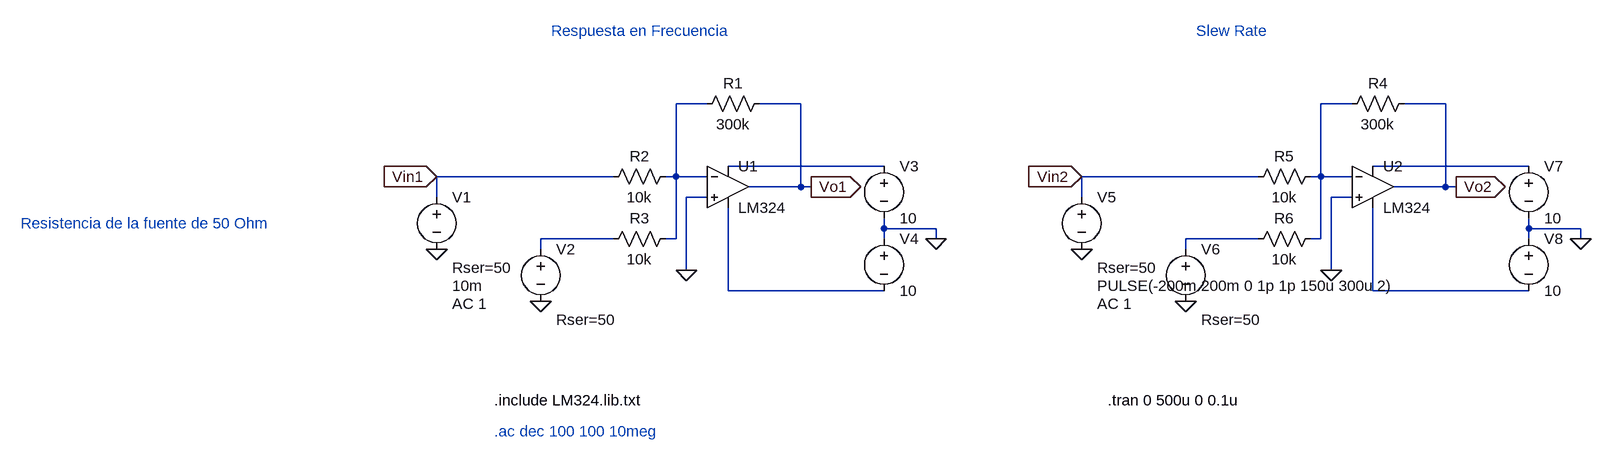
[diagram p0: schematic TP2_2.asc]
TP2_2.asc, the LTspice schematic file:
Version 4
SHEET 1 4432 1132
WIRE 176 -80 128 -80
WIRE 320 -80 256 -80
WIRE 1168 -80 1120 -80
WIRE 1312 -80 1248 -80
WIRE 448 16 208 16
WIRE 1440 16 1200 16
WIRE 32 32 -240 32
WIRE 128 32 128 -80
WIRE 128 32 112 32
WIRE 176 32 128 32
WIRE 1024 32 752 32
WIRE 1120 32 1120 -80
WIRE 1120 32 1104 32
WIRE 1168 32 1120 32
WIRE 320 48 320 -80
WIRE 320 48 240 48
WIRE 336 48 320 48
WIRE 1312 48 1312 -80
WIRE 1312 48 1232 48
WIRE 1328 48 1312 48
WIRE -240 64 -240 32
WIRE 176 64 144 64
WIRE 752 64 752 32
WIRE 1168 64 1136 64
WIRE 448 112 448 96
WIRE 528 112 448 112
WIRE 1440 112 1440 96
WIRE 1520 112 1440 112
WIRE 32 128 -80 128
WIRE 128 128 128 32
WIRE 128 128 112 128
WIRE 448 128 448 112
WIRE 528 128 528 112
WIRE 1024 128 912 128
WIRE 1120 128 1120 32
WIRE 1120 128 1104 128
WIRE 1440 128 1440 112
WIRE 1520 128 1520 112
WIRE -80 144 -80 128
WIRE 912 144 912 128
WIRE 144 176 144 64
WIRE 1136 176 1136 64
WIRE 208 208 208 80
WIRE 448 208 208 208
WIRE 1200 208 1200 80
WIRE 1440 208 1200 208
FLAG -80 224 0
FLAG -240 144 0
FLAG 528 128 0
FLAG 144 176 0
FLAG 336 48 Vo1
IOPIN 336 48 Out
FLAG -240 32 Vin1
IOPIN -240 32 In
FLAG 912 224 0
FLAG 752 144 0
FLAG 1520 128 0
FLAG 1136 176 0
FLAG 1328 48 Vo2
IOPIN 1328 48 Out
FLAG 752 32 Vin2
IOPIN 752 32 In
SYMBOL voltage -240 48 R0
WINDOW 123 24 180 Left 2
WINDOW 39 24 124 Left 2
WINDOW 3 24 152 Left 2
SYMATTR Value2 AC 1
SYMATTR SpiceLine Rser=50
SYMATTR Value 10m
SYMATTR InstName V1
SYMBOL voltage -80 128 R0
WINDOW 123 0 0 Left 0
WINDOW 39 24 124 Left 2
SYMATTR SpiceLine Rser=50
SYMATTR InstName V2
SYMATTR Value ""
SYMBOL OpAmps\\opamp2 208 -16 R0
SYMATTR InstName U1
SYMATTR Value LM324
SYMBOL voltage 448 0 R0
WINDOW 123 0 0 Left 0
WINDOW 39 0 0 Left 0
SYMATTR InstName V3
SYMATTR Value 10
SYMBOL res 272 -96 R90
WINDOW 0 0 56 VBottom 2
WINDOW 3 32 56 VTop 2
SYMATTR InstName R1
SYMATTR Value 300k
SYMBOL res 128 16 R90
WINDOW 0 0 56 VBottom 2
WINDOW 3 32 56 VTop 2
SYMATTR InstName R2
SYMATTR Value 10k
SYMBOL res 128 112 R90
WINDOW 0 0 56 VBottom 2
WINDOW 3 32 56 VTop 2
SYMATTR InstName R3
SYMATTR Value 10k
SYMBOL voltage 448 112 R0
WINDOW 123 0 0 Left 0
WINDOW 39 0 0 Left 0
SYMATTR InstName V4
SYMATTR Value 10
SYMBOL voltage 752 48 R0
WINDOW 123 24 180 Left 2
WINDOW 39 24 124 Left 2
WINDOW 3 24 152 Left 2
SYMATTR Value2 AC 1
SYMATTR SpiceLine Rser=50
SYMATTR Value PULSE(-200m 200m 0 1p 1p 150u 300u 2)
SYMATTR InstName V5
SYMBOL voltage 912 128 R0
WINDOW 123 0 0 Left 0
WINDOW 39 24 124 Left 2
SYMATTR SpiceLine Rser=50
SYMATTR InstName V6
SYMATTR Value ""
SYMBOL OpAmps\\opamp2 1200 -16 R0
SYMATTR InstName U2
SYMATTR Value LM324
SYMBOL voltage 1440 0 R0
WINDOW 123 0 0 Left 0
WINDOW 39 0 0 Left 0
SYMATTR InstName V7
SYMATTR Value 10
SYMBOL res 1264 -96 R90
WINDOW 0 0 56 VBottom 2
WINDOW 3 32 56 VTop 2
SYMATTR InstName R4
SYMATTR Value 300k
SYMBOL res 1120 16 R90
WINDOW 0 0 56 VBottom 2
WINDOW 3 32 56 VTop 2
SYMATTR InstName R5
SYMATTR Value 10k
SYMBOL res 1120 112 R90
WINDOW 0 0 56 VBottom 2
WINDOW 3 32 56 VTop 2
SYMATTR InstName R6
SYMATTR Value 10k
SYMBOL voltage 1440 112 R0
WINDOW 123 0 0 Left 0
WINDOW 39 0 0 Left 0
SYMATTR InstName V8
SYMATTR Value 10
TEXT -152 376 Left 2 !.include LM324.lib.txt
TEXT -64 -192 Left 2 ;Respuesta en Frecuencia
TEXT -880 104 Left 2 ;Resistencia de la fuente de 50 Ohm
TEXT -152 424 Left 2 ;.ac dec 100 100 10meg
TEXT 928 -192 Left 2 ;Slew Rate
TEXT 792 376 Left 2 !.tran 0 500u 0 0.1u

The netlist it stands for:
* TP2_2.asc
V1 Vin1 0 10m AC 1 Rser=50
V2 N005 0 Rser=50
XU1 0 N001 N003 N007 Vo1 LM324  ; pins In+ In- V+ V- OUT
V3 N003 0 10
R1 Vo1 N001 300k
R2 N001 Vin1 10k
R3 N001 N005 10k
V4 0 N007 10
V5 Vin2 0 PULSE(-200m 200m 0 1p 1p 150u 300u 2) AC 1 Rser=50
V6 N006 0 Rser=50
XU2 0 N002 N004 N008 Vo2 LM324  ; pins In+ In- V+ V- OUT
V7 N004 0 10
R4 Vo2 N002 300k
R5 N002 Vin2 10k
R6 N002 N006 10k
V8 0 N008 10
.include LM324.lib.txt
* Respuesta en Frecuencia
* Resistencia de la fuente de 50 Ohm
* .ac dec 100 100 10meg
* Slew Rate
.tran 0 500u 0 0.1u
.backanno
.end